# Altium schematic sheet 3.3V_Regulator.SchDoc
size A; SheetNumber: 11; SheetTotal: 15
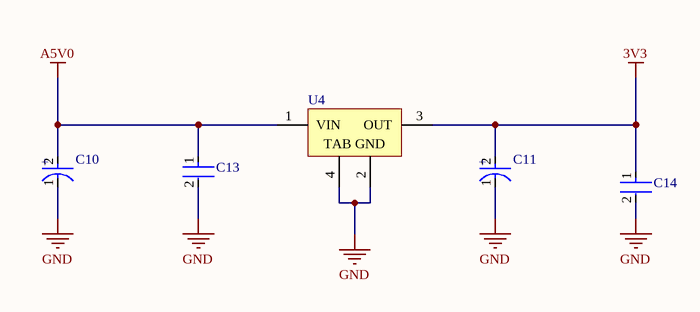
[diagram p0: 3.3V_Regulator.SchDoc]

## Parts
C10  UUR1C221MCL6GS  [FP-UUR1C221MCL6GS-MFG]  (value not drawn)
C11  UUR1C221MCL6GS  [FP-UUR1C221MCL6GS-MFG]  (value not drawn)
C13  GRM022R60J104ME15L  [CAPC0402X22N]  (value not drawn)
C14  GRM022R60J104ME15L  [CAPC2012X88N]  (value not drawn)
U4  LT1121CST-3.3#TRPBF  [LT-ST-3-SOT-223_N]  (value not drawn)

## Nets
3V3: C11.2(A) C14.1 U4.3(OUT)
A5V0: C10.2(A) C13.1 U4.1(VIN)
GND: C10.1(C) C11.1(C) C13.2 C14.2 U4.2(GND) U4.4(TAB)

## Notes on the sheet
- (in symbol UUR1C221MCL6GS) +

## Library data of the parts
C10 C11 = UUR1C221MCL6GS: Cap Aluminum Lytic 220uF 16V 20% (6.3 X 7.7mm) SMD 162mA 2000h 85C T/R; Manufacturer: Nichicon; Leakage Current: 16.5uA; Life (Hours): 2000Hour; Dissipation Factor: 0.2%; Supplier 1: Mouser; Manufacturer Part Number: UUR1C221MCL6GS; RoHS: Yes; Category: Aluminum Electrolytic Capacitors; Pricing 1: 1=0.45000, 10=0.31200, 50=0.31200, 100=0.18700, 500=0.14100, 1000=0.14100, 10000=0.14100 (USD); Mount: Surface Mount; Case/Package: Radial; Min Operating Temperature: -40°C; Max Operating Temperature: 85°C; Capacitance: 220uF; Tolerance: 20%; Ripple Current: 162mA; Package Quantity: 900; Voltage Rating: 16V; Packaging: Tape and Reel; Voltage Rating (DC): 16V; Termination: SMD/SMT; Features: General Purpose; Series: UR; Construction: Cylindrical; Diameter: 6.3mm; Length: 7.7mm; Height: 7.7mm; Height - Seated (Max): 0.315inch; Radiation Hardening: No; Lead Free: Lead Free; RoHS Compliant: Yes; ComponentLink1URL: https://datasheet.ciiva.com/6328/e-ur-6328141.pdf?src-supplier=Digi-Key; ComponentLink1Description: https://datasheet.ciiva.com/6328/e-ur-6328141.pdf?src-supplier=Digi-Key; ComponentLink2URL: https://datasheet.ciiva.com/6328/e-ur-6328143.pdf?src-supplier=Digi-Key; ComponentLink2Description: https://datasheet.ciiva.com/6328/e-ur-6328143.pdf?src-supplier=Digi-Key; ComponentLink3URL: https://datasheet.ciiva.com/11686/e-ur-11686685.pdf?src-supplier=Avnet; ComponentLink3Description: https://datasheet.ciiva.com/11686/e-ur-11686685.pdf?src-supplier=Avnet; ComponentLink4URL: https://datasheet.ciiva.com/16502/e-ur-16502798.pdf?src-supplier=Future+Electronics; ComponentLink4Description: https://datasheet.ciiva.com/16502/e-ur-16502798.pdf?src-supplier=Future+Electronics; ComponentLink5URL: https://datasheet.ciiva.com/17526/e-ur-17526773.pdf?src-supplier=Avnet+Europe; ComponentLink5Description: https://datasheet.ciiva.com/17526/e-ur-17526773.pdf?src-supplier=Avnet+Europe; Supplier Part Number 1: 647-UUR1C221MCL6GS; Stock 1: 78
C13 C14 = C0603C104K5RACTU: Multilayer Ceramic Capacitors (MLCC) - SMD/SMT 50volts 0.1uF X7R 10%; Manufacturer: KEMET; Voltage Rating (DC): 50V; Capacitance: 100nF; Dissipation Factor: 2.5%; Supplier 1: Digi-Key; Manufacturer Part Number: C0603C104K5RACTU; RoHS: Yes; Category: Ceramic Capacitors; Pricing 1: 1=0.12000, 10=0.08500, 50=0.04620, 100=0.03770, 500=0.02696, 1000=0.02118 (USD); Mount: Surface Mount; Case/Package: 0603; Number of Pins: 2; Case Code (Metric): 1608; Case Code (Imperial): 0603; Dielectric Material: Ceramic; Contact Plating: Tin,Matte; Min Operating Temperature: -55°C; Max Operating Temperature: 125°C; Tolerance: 10%; Voltage Rating: 50V; Packaging: Tape and Reel; Package Quantity: 1; Dielectric: X7R; Termination: SMD/SMT; Voltage: 50V; Series: SMD Comm X7R; Length: 0.063inch; Width: 0.031inch; Height: 0.8mm; Thickness: 0.034inch; Depth: 0.8mm; Lead Pitch: 0.7mm; Radiation Hardening: No; REACH SVHC: No SVHC; RoHS Compliant: Yes; ComponentLink1URL: https://datasheet.ciiva.com/7823/kem-c1002-x7r-smd-7823591.pdf?src-supplier=Element14; ComponentLink1Description: https://datasheet.ciiva.com/7823/kem-c1002-x7r-smd-7823591.pdf?src-supplier=Element14; ComponentLink2URL: https://datasheet.ciiva.com/7823/kem-c1002-x7r-smd-7823592.pdf?src-supplier=Element14; ComponentLink2Description: https://datasheet.ciiva.com/7823/kem-c1002-x7r-smd-7823592.pdf?src-supplier=Element14; ComponentLink3URL: https://datasheet.ciiva.com/5999/kem-c1002-x7r-smd-5999400.pdf?src-supplier=Farnell; ComponentLink3Description: https://datasheet.ciiva.com/5999/kem-c1002-x7r-smd-5999400.pdf?src-supplier=Farnell; ComponentLink4URL: https://datasheet.ciiva.com/28645/1851736-28645640.pdf?src-supplier=Element14; ComponentLink4Description: https://datasheet.ciiva.com/28645/1851736-28645640.pdf?src-supplier=Element14; ComponentLink5URL: https://datasheet.ciiva.com/14585/70095383-14585209.pdf?src-supplier=Allied+Electronics; ComponentLink5Description: https://datasheet.ciiva.com/14585/70095383-14585209.pdf?src-supplier=Allied+Electronics; ComponentLink6URL: https://datasheet.ciiva.com/14602/70095383-14602583.pdf?src-supplier=Allied+Electronics; ComponentLink6Description: https://datasheet.ciiva.com/14602/70095383-14602583.pdf?src-supplier=Allied+Electronics; Supplier Part Number 1: 399-C0603C104K5RAC7867CT-ND; Stock 1: 10133409
U4 = CMP-0476-01801-1: Micropower Low Dropout Regulator with Shutdown, 4.17 to 36 V Vin, 3.3 V Vout, 3-pin SOT223 (ST-3), 0 to 125 degC, Pb-Free, Tape and Reel; Manufacturer: Linear Technology; Vin Max(V): 36; Isupply(mA): 0.03; Iout(mA): 150; Output Voltage: 3.3 V; Vin Min(V): 4.17; Number of Outputs: 1; Shutdown Current(uA): 16; Discrete Pass Element: no; Dropout Voltage(V): 0.42; ComponentLink2URL: http://cds.linear.com/docs/en/datasheet/1121fg.pdf; Packing: Tape and Reel; PartNumber: LT1121CST-3.3#TRPBF; PackageReference: ST-3; Mounting Technology: Surface Mount; ComponentLink1Description: Manufacturer URL; PackageVersion: Jun-10; RoHS: TRUE; ComponentLink3URL: http://cds.linear.com/docs/en/packaging/SOT_3_05-08-1630.pdf; ComponentLink1URL: http://www.linear.com/; ComponentLink2Description: Datasheet; ComponentLink3Description: Package Specification; DatasheetVersion: Rev. G; PackageDescription: 3-Pin Plastic SOT-223, 3.505 x 6.505 mm Body, Pitch 2.3 mm